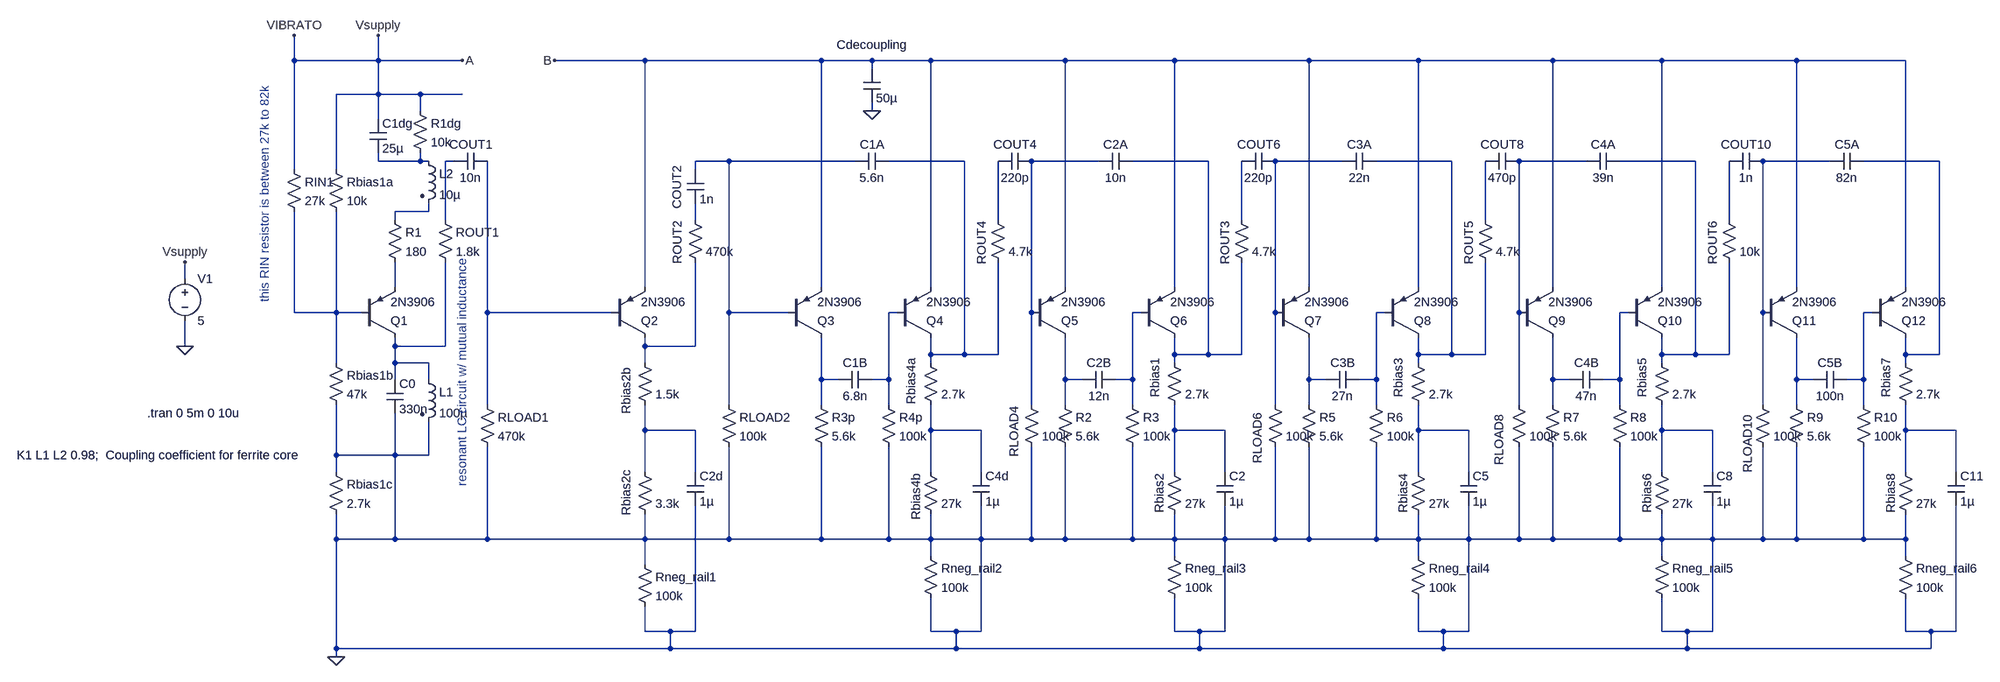
[diagram p0: schematic Farfisa 12-Tone Generator Osc Card G-10.asc]
Farfisa 12-Tone Generator Osc Card G-10.asc, the LTspice schematic file:
Version 4.1
SHEET 1 3172 916
WIRE -160 -240 -160 -288
WIRE 0 -240 0 -288
WIRE 0 -240 -160 -240
WIRE 160 -240 0 -240
WIRE 528 -240 336 -240
WIRE 864 -240 528 -240
WIRE 960 -240 864 -240
WIRE 1072 -240 960 -240
WIRE 1328 -240 1072 -240
WIRE 1536 -240 1328 -240
WIRE 1792 -240 1536 -240
WIRE 2000 -240 1792 -240
WIRE 2256 -240 2000 -240
WIRE 2464 -240 2256 -240
WIRE 2720 -240 2464 -240
WIRE 2928 -240 2720 -240
WIRE 960 -224 960 -240
WIRE 0 -176 0 -240
WIRE 0 -176 -80 -176
WIRE 80 -176 0 -176
WIRE 160 -176 80 -176
WIRE 80 -144 80 -176
WIRE 960 -144 960 -160
WIRE 0 -128 0 -176
WIRE 0 -48 0 -64
WIRE 80 -48 80 -64
WIRE 80 -48 0 -48
WIRE 96 -48 80 -48
WIRE 144 -48 128 -48
WIRE 688 -48 624 -48
WIRE 928 -48 688 -48
WIRE 1136 -48 992 -48
WIRE 1392 -48 1264 -48
WIRE 1600 -48 1456 -48
WIRE 1856 -48 1728 -48
WIRE 2064 -48 1920 -48
WIRE 2320 -48 2192 -48
WIRE 2528 -48 2384 -48
WIRE 2784 -48 2656 -48
WIRE 2992 -48 2848 -48
WIRE -160 -32 -160 -240
WIRE -80 -32 -80 -176
WIRE 624 -32 624 -48
WIRE 96 48 96 32
WIRE 96 48 32 48
WIRE 32 64 32 48
WIRE 128 64 128 -48
WIRE 624 64 624 32
WIRE 1200 64 1200 -48
WIRE 1664 64 1664 -48
WIRE 2128 64 2128 -48
WIRE 2592 64 2592 -48
WIRE -368 176 -368 144
WIRE 32 192 32 144
WIRE 528 192 528 -240
WIRE 864 192 864 -240
WIRE 1072 192 1072 -240
WIRE 1328 192 1328 -240
WIRE 1536 192 1536 -240
WIRE 1792 192 1792 -240
WIRE 2000 192 2000 -240
WIRE 2256 192 2256 -240
WIRE 2464 192 2464 -240
WIRE 2720 192 2720 -240
WIRE 2928 192 2928 -240
WIRE -160 240 -160 48
WIRE -80 240 -80 48
WIRE -80 240 -160 240
WIRE -32 240 -80 240
WIRE 208 240 208 -48
WIRE 464 240 208 240
WIRE 688 240 688 -48
WIRE 800 240 688 240
WIRE 1008 240 992 240
WIRE 1264 240 1264 -48
WIRE 1472 240 1456 240
WIRE 1728 240 1728 -48
WIRE 1936 240 1920 240
WIRE 2192 240 2192 -48
WIRE 2400 240 2384 240
WIRE 2656 240 2656 -48
WIRE 2864 240 2848 240
WIRE -368 304 -368 256
WIRE 32 304 32 288
WIRE 128 304 128 144
WIRE 128 304 32 304
WIRE 528 304 528 288
WIRE 624 304 624 144
WIRE 624 304 528 304
WIRE 1072 320 1072 288
WIRE 1136 320 1136 -48
WIRE 1136 320 1072 320
WIRE 1200 320 1200 144
WIRE 1200 320 1136 320
WIRE 1536 320 1536 288
WIRE 1600 320 1600 -48
WIRE 1600 320 1536 320
WIRE 1664 320 1664 144
WIRE 1664 320 1600 320
WIRE 2000 320 2000 288
WIRE 2064 320 2064 -48
WIRE 2064 320 2000 320
WIRE 2128 320 2128 144
WIRE 2128 320 2064 320
WIRE 2464 320 2464 288
WIRE 2528 320 2528 -48
WIRE 2528 320 2464 320
WIRE 2592 320 2592 144
WIRE 2592 320 2528 320
WIRE 2928 320 2928 288
WIRE 2992 320 2992 -48
WIRE 2992 320 2928 320
WIRE -80 336 -80 240
WIRE 32 336 32 304
WIRE 96 336 32 336
WIRE 528 336 528 304
WIRE 1072 336 1072 320
WIRE 1536 336 1536 320
WIRE 2000 336 2000 320
WIRE 2464 336 2464 320
WIRE 2928 336 2928 320
WIRE 32 368 32 336
WIRE 96 368 96 336
WIRE 864 368 864 288
WIRE 896 368 864 368
WIRE 992 368 992 240
WIRE 992 368 960 368
WIRE 1328 368 1328 288
WIRE 1360 368 1328 368
WIRE 1456 368 1456 240
WIRE 1456 368 1424 368
WIRE 1792 368 1792 288
WIRE 1824 368 1792 368
WIRE 1920 368 1920 240
WIRE 1920 368 1888 368
WIRE 2256 368 2256 288
WIRE 2288 368 2256 368
WIRE 2384 368 2384 240
WIRE 2384 368 2352 368
WIRE 2720 368 2720 288
WIRE 2752 368 2720 368
WIRE 2848 368 2848 240
WIRE 2848 368 2816 368
WIRE 208 416 208 240
WIRE 688 416 688 240
WIRE 864 416 864 368
WIRE 992 416 992 368
WIRE 1264 416 1264 240
WIRE 1328 416 1328 368
WIRE 1456 416 1456 368
WIRE 1728 416 1728 240
WIRE 1792 416 1792 368
WIRE 1920 416 1920 368
WIRE 2192 416 2192 240
WIRE 2256 416 2256 368
WIRE 2384 416 2384 368
WIRE 2656 416 2656 240
WIRE 2720 416 2720 368
WIRE 2848 416 2848 368
WIRE 528 464 528 416
WIRE 624 464 528 464
WIRE 1072 464 1072 416
WIRE 1168 464 1072 464
WIRE 1536 464 1536 416
WIRE 1632 464 1536 464
WIRE 2000 464 2000 416
WIRE 2096 464 2000 464
WIRE 2464 464 2464 416
WIRE 2560 464 2464 464
WIRE 2928 464 2928 416
WIRE 3024 464 2928 464
WIRE -80 512 -80 416
WIRE 32 512 32 432
WIRE 32 512 -80 512
WIRE 96 512 96 448
WIRE 96 512 32 512
WIRE -80 544 -80 512
WIRE 528 544 528 464
WIRE 624 544 624 464
WIRE 1072 544 1072 464
WIRE 1168 544 1168 464
WIRE 1536 544 1536 464
WIRE 1632 544 1632 464
WIRE 2000 544 2000 464
WIRE 2096 544 2096 464
WIRE 2464 544 2464 464
WIRE 2560 544 2560 464
WIRE 2928 544 2928 464
WIRE 3024 544 3024 464
WIRE -80 672 -80 624
WIRE 32 672 32 512
WIRE 32 672 -80 672
WIRE 208 672 208 496
WIRE 208 672 32 672
WIRE 528 672 528 624
WIRE 528 672 208 672
WIRE 688 672 688 496
WIRE 688 672 528 672
WIRE 864 672 864 496
WIRE 864 672 688 672
WIRE 992 672 992 496
WIRE 992 672 864 672
WIRE 1072 672 1072 624
WIRE 1072 672 992 672
WIRE 1168 672 1168 608
WIRE 1168 672 1072 672
WIRE 1264 672 1264 496
WIRE 1264 672 1168 672
WIRE 1328 672 1328 496
WIRE 1328 672 1264 672
WIRE 1456 672 1456 496
WIRE 1456 672 1328 672
WIRE 1536 672 1536 624
WIRE 1536 672 1456 672
WIRE 1632 672 1632 608
WIRE 1632 672 1536 672
WIRE 1728 672 1728 496
WIRE 1728 672 1632 672
WIRE 1792 672 1792 496
WIRE 1792 672 1728 672
WIRE 1920 672 1920 496
WIRE 1920 672 1792 672
WIRE 2000 672 2000 624
WIRE 2000 672 1920 672
WIRE 2096 672 2096 608
WIRE 2096 672 2000 672
WIRE 2192 672 2192 496
WIRE 2192 672 2096 672
WIRE 2256 672 2256 496
WIRE 2256 672 2192 672
WIRE 2384 672 2384 496
WIRE 2384 672 2256 672
WIRE 2464 672 2464 624
WIRE 2464 672 2384 672
WIRE 2560 672 2560 608
WIRE 2560 672 2464 672
WIRE 2656 672 2656 496
WIRE 2656 672 2560 672
WIRE 2720 672 2720 496
WIRE 2720 672 2656 672
WIRE 2848 672 2848 496
WIRE 2848 672 2720 672
WIRE 2928 672 2928 624
WIRE 2928 672 2848 672
WIRE 1072 704 1072 672
WIRE 1536 704 1536 672
WIRE 2000 704 2000 672
WIRE 2464 704 2464 672
WIRE 2928 704 2928 672
WIRE 528 720 528 672
WIRE 528 848 528 800
WIRE 576 848 528 848
WIRE 624 848 624 608
WIRE 624 848 576 848
WIRE 1072 848 1072 784
WIRE 1120 848 1072 848
WIRE 1168 848 1168 672
WIRE 1168 848 1120 848
WIRE 1536 848 1536 784
WIRE 1584 848 1536 848
WIRE 1632 848 1632 672
WIRE 1632 848 1584 848
WIRE 2000 848 2000 784
WIRE 2048 848 2000 848
WIRE 2096 848 2096 672
WIRE 2096 848 2048 848
WIRE 2464 848 2464 784
WIRE 2512 848 2464 848
WIRE 2560 848 2560 672
WIRE 2560 848 2512 848
WIRE 2928 848 2928 784
WIRE 2976 848 2928 848
WIRE 3024 848 3024 608
WIRE 3024 848 2976 848
WIRE -80 880 -80 672
WIRE 576 880 576 848
WIRE 576 880 -80 880
WIRE 1120 880 1120 848
WIRE 1120 880 576 880
WIRE 1584 880 1584 848
WIRE 1584 880 1120 880
WIRE 2048 880 2048 848
WIRE 2048 880 1584 880
WIRE 2512 880 2512 848
WIRE 2512 880 2048 880
WIRE 2976 880 2976 848
WIRE 2976 880 2512 880
WIRE -80 896 -80 880
FLAG -368 304 0
FLAG -368 144 Vsupply
FLAG -160 -288 VIBRATO
FLAG 0 -288 Vsupply
FLAG -80 896 0
FLAG 160 -240 A
FLAG 336 -240 B
FLAG 960 -144 0
SYMBOL pnp -32 288 M180
SYMATTR InstName Q1
SYMATTR Value 2N3906
SYMBOL Res 16 48 R0
SYMATTR InstName R1
SYMATTR Value 180
SYMBOL ind2 80 -64 R0
SYMATTR InstName L2
SYMATTR Value 10µ
SYMATTR Type ind
SYMBOL Cap -16 -128 R0
SYMATTR InstName C1dg
SYMATTR Value 25µ
SYMBOL Res 64 -160 R0
SYMATTR InstName R1dg
SYMATTR Value 10k
SYMBOL Cap 16 368 R0
SYMATTR InstName C0
SYMATTR Value 330n
SYMBOL ind2 80 352 R0
SYMATTR InstName L1
SYMATTR Value 100µ
SYMATTR Type ind
SYMBOL Res -96 320 R0
SYMATTR InstName Rbias1b
SYMATTR Value 47k
SYMBOL Res -96 528 R0
SYMATTR InstName Rbias1c
SYMATTR Value 2.7k
SYMBOL Res -96 -48 R0
SYMATTR InstName Rbias1a
SYMATTR Value 10k
SYMBOL Res -176 -48 R0
SYMATTR InstName RIN1
SYMATTR Value 27k
SYMBOL Res 112 48 R0
SYMATTR InstName ROUT1
SYMATTR Value 1.8k
SYMBOL Cap 208 -64 R90
WINDOW 0 0 32 VBottom 2
WINDOW 3 32 32 VTop 2
SYMATTR InstName COUT1
SYMATTR Value 10n
SYMBOL Res 192 400 R0
SYMATTR InstName RLOAD1
SYMATTR Value 470k
SYMBOL Voltage -368 160 R0
SYMATTR InstName V1
SYMATTR Value 5
SYMBOL pnp 464 288 M180
SYMATTR InstName Q2
SYMATTR Value 2N3906
SYMBOL res 512 320 R0
WINDOW 0 -19 25 VRight 2
SYMATTR InstName Rbias2b
SYMATTR Value 1.5k
SYMBOL res 512 528 R0
WINDOW 0 -19 12 VRight 2
SYMATTR InstName Rbias2c
SYMATTR Value 3.3k
SYMBOL cap 608 544 R0
SYMATTR InstName C2d
SYMATTR Value 1µ
SYMBOL res 512 704 R0
SYMATTR InstName Rneg_rail1
SYMATTR Value 100k
SYMBOL res 608 48 R0
WINDOW 0 -18 18 VRight 2
SYMATTR InstName ROUT2
SYMATTR Value 470k
SYMBOL cap 608 -32 R0
WINDOW 0 -19 -7 VRight 2
SYMATTR InstName COUT2
SYMATTR Value 1n
SYMBOL res 672 400 R0
SYMATTR InstName RLOAD2
SYMATTR Value 100k
SYMBOL pnp 800 288 M180
SYMATTR InstName Q3
SYMATTR Value 2N3906
SYMBOL res 848 400 R0
SYMATTR InstName R3p
SYMATTR Value 5.6k
SYMBOL cap 960 352 R90
WINDOW 0 0 32 VBottom 2
WINDOW 3 32 32 VTop 2
SYMATTR InstName C1B
SYMATTR Value 6.8n
SYMBOL res 976 400 R0
SYMATTR InstName R4p
SYMATTR Value 100k
SYMBOL pnp 1008 288 M180
SYMATTR InstName Q4
SYMATTR Value 2N3906
SYMBOL res 1056 320 R0
WINDOW 0 -21 7 VRight 2
SYMATTR InstName Rbias4a
SYMATTR Value 2.7k
SYMBOL res 1056 528 R0
WINDOW 0 -12 19 VRight 2
SYMATTR InstName Rbias4b
SYMATTR Value 27k
SYMBOL cap 1152 544 R0
SYMATTR InstName C4d
SYMATTR Value 1µ
SYMBOL cap 992 -64 R90
WINDOW 0 0 32 VBottom 2
WINDOW 3 32 32 VTop 2
SYMATTR InstName C1A
SYMATTR Value 5.6n
SYMBOL cap 944 -224 R0
WINDOW 0 -51 -46 Left 2
SYMATTR InstName Cdecoupling
SYMATTR Value 50µ
SYMBOL res 1184 48 R0
WINDOW 0 -15 19 VRight 2
SYMATTR InstName ROUT4
SYMATTR Value 4.7k
SYMBOL cap 1264 -64 R90
WINDOW 0 0 32 VBottom 2
WINDOW 3 32 32 VTop 2
SYMATTR InstName COUT4
SYMATTR Value 220p
SYMBOL pnp 1264 288 M180
SYMATTR InstName Q5
SYMATTR Value 2N3906
SYMBOL res 1312 400 R0
SYMATTR InstName R2
SYMATTR Value 5.6k
SYMBOL cap 1424 352 R90
WINDOW 0 0 32 VBottom 2
WINDOW 3 32 32 VTop 2
SYMATTR InstName C2B
SYMATTR Value 12n
SYMBOL res 1440 400 R0
SYMATTR InstName R3
SYMATTR Value 100k
SYMBOL pnp 1472 288 M180
SYMATTR InstName Q6
SYMATTR Value 2N3906
SYMBOL res 1520 320 R0
WINDOW 0 -21 7 VRight 2
SYMATTR InstName Rbias1
SYMATTR Value 2.7k
SYMBOL res 1520 528 R0
WINDOW 0 -12 19 VRight 2
SYMATTR InstName Rbias2
SYMATTR Value 27k
SYMBOL cap 1616 544 R0
SYMATTR InstName C2
SYMATTR Value 1µ
SYMBOL cap 1456 -64 R90
WINDOW 0 0 32 VBottom 2
WINDOW 3 32 32 VTop 2
SYMATTR InstName C2A
SYMATTR Value 10n
SYMBOL res 1648 48 R0
WINDOW 0 -15 19 VRight 2
SYMATTR InstName ROUT3
SYMATTR Value 4.7k
SYMBOL cap 1728 -64 R90
WINDOW 0 0 32 VBottom 2
WINDOW 3 32 32 VTop 2
SYMATTR InstName COUT6
SYMATTR Value 220p
SYMBOL res 1776 400 R0
SYMATTR InstName R5
SYMATTR Value 5.6k
SYMBOL cap 1888 352 R90
WINDOW 0 0 32 VBottom 2
WINDOW 3 32 32 VTop 2
SYMATTR InstName C3B
SYMATTR Value 27n
SYMBOL res 1904 400 R0
SYMATTR InstName R6
SYMATTR Value 100k
SYMBOL res 1984 320 R0
WINDOW 0 -21 7 VRight 2
SYMATTR InstName Rbias3
SYMATTR Value 2.7k
SYMBOL res 1984 528 R0
WINDOW 0 -12 19 VRight 2
SYMATTR InstName Rbias4
SYMATTR Value 27k
SYMBOL cap 2080 544 R0
SYMATTR InstName C5
SYMATTR Value 1µ
SYMBOL cap 1920 -64 R90
WINDOW 0 0 32 VBottom 2
WINDOW 3 32 32 VTop 2
SYMATTR InstName C3A
SYMATTR Value 22n
SYMBOL res 2112 48 R0
WINDOW 0 -15 19 VRight 2
SYMATTR InstName ROUT5
SYMATTR Value 4.7k
SYMBOL cap 2192 -64 R90
WINDOW 0 0 32 VBottom 2
WINDOW 3 32 32 VTop 2
SYMATTR InstName COUT8
SYMATTR Value 470p
SYMBOL pnp 1728 288 M180
SYMATTR InstName Q7
SYMATTR Value 2N3906
SYMBOL pnp 1936 288 M180
SYMATTR InstName Q8
SYMATTR Value 2N3906
SYMBOL res 2240 400 R0
SYMATTR InstName R7
SYMATTR Value 5.6k
SYMBOL cap 2352 352 R90
WINDOW 0 0 32 VBottom 2
WINDOW 3 32 32 VTop 2
SYMATTR InstName C4B
SYMATTR Value 47n
SYMBOL res 2368 400 R0
SYMATTR InstName R8
SYMATTR Value 100k
SYMBOL res 2448 320 R0
WINDOW 0 -21 7 VRight 2
SYMATTR InstName Rbias5
SYMATTR Value 2.7k
SYMBOL res 2448 528 R0
WINDOW 0 -12 19 VRight 2
SYMATTR InstName Rbias6
SYMATTR Value 27k
SYMBOL cap 2544 544 R0
SYMATTR InstName C8
SYMATTR Value 1µ
SYMBOL cap 2384 -64 R90
WINDOW 0 0 32 VBottom 2
WINDOW 3 32 32 VTop 2
SYMATTR InstName C4A
SYMATTR Value 39n
SYMBOL res 2576 48 R0
WINDOW 0 -15 19 VRight 2
SYMATTR InstName ROUT6
SYMATTR Value 10k
SYMBOL cap 2656 -64 R90
WINDOW 0 0 32 VBottom 2
WINDOW 3 32 32 VTop 2
SYMATTR InstName COUT10
SYMATTR Value 1n
SYMBOL pnp 2192 288 M180
SYMATTR InstName Q9
SYMATTR Value 2N3906
SYMBOL pnp 2400 288 M180
SYMATTR InstName Q10
SYMATTR Value 2N3906
SYMBOL res 2704 400 R0
SYMATTR InstName R9
SYMATTR Value 5.6k
SYMBOL cap 2816 352 R90
WINDOW 0 0 32 VBottom 2
WINDOW 3 32 32 VTop 2
SYMATTR InstName C5B
SYMATTR Value 100n
SYMBOL res 2832 400 R0
SYMATTR InstName R10
SYMATTR Value 100k
SYMBOL res 2912 320 R0
WINDOW 0 -21 7 VRight 2
SYMATTR InstName Rbias7
SYMATTR Value 2.7k
SYMBOL res 2912 528 R0
WINDOW 0 -12 19 VRight 2
SYMATTR InstName Rbias8
SYMATTR Value 27k
SYMBOL cap 3008 544 R0
SYMATTR InstName C11
SYMATTR Value 1µ
SYMBOL cap 2848 -64 R90
WINDOW 0 0 32 VBottom 2
WINDOW 3 32 32 VTop 2
SYMATTR InstName C5A
SYMATTR Value 82n
SYMBOL pnp 2656 288 M180
SYMATTR InstName Q11
SYMATTR Value 2N3906
SYMBOL pnp 2864 288 M180
SYMATTR InstName Q12
SYMATTR Value 2N3906
SYMBOL res 1248 400 R0
WINDOW 0 -17 19 VRight 2
SYMATTR InstName RLOAD4
SYMATTR Value 100k
SYMBOL res 1712 400 R0
WINDOW 0 -18 32 VRight 2
SYMATTR InstName RLOAD6
SYMATTR Value 100k
SYMBOL res 2176 400 R0
WINDOW 0 -22 35 VRight 2
SYMATTR InstName RLOAD8
SYMATTR Value 100k
SYMBOL res 2640 400 R0
WINDOW 0 -12 36 VRight 2
SYMATTR InstName RLOAD10
SYMATTR Value 100k
SYMBOL res 1056 688 R0
SYMATTR InstName Rneg_rail2
SYMATTR Value 100k
SYMBOL res 1520 688 R0
SYMATTR InstName Rneg_rail3
SYMATTR Value 100k
SYMBOL res 1984 688 R0
SYMATTR InstName Rneg_rail4
SYMATTR Value 100k
SYMBOL res 2448 688 R0
SYMATTR InstName Rneg_rail5
SYMATTR Value 100k
SYMBOL res 2912 688 R0
SYMATTR InstName Rneg_rail6
SYMATTR Value 100k
TEXT 160 136 VRight 2 ;resonant LC circuit w/ mutual inductance
TEXT -216 -192 VRight 2 ;this RIN resistor is between 27k to 82k
TEXT -688 512 Left 2 !K1 L1 L2 0.98;  Coupling coefficient for ferrite core
TEXT -440 432 Left 2 !.tran 0 5m 0 10u

The netlist it stands for:
* Farfisa 12-Tone Generator Osc Card G-10.asc
Q1 N027 N020 N019 0 2N3906
R1 N013 N019 180
L2 N001 N013 10µ
C1dg A N001 25µ
R1dg A N001 10k
C0 N027 0 330n
L1 N027 0 100µ
Rbias1b N020 0 47k
Rbias1c 0 0 2.7k
Rbias1a A N020 10k
RIN1 A N020 27k
ROUT1 N002 N027 1.8k
COUT1 N021 N002 10n
RLOAD1 N021 0 470k
V1 A 0 5
Q2 N028 N021 B 0 2N3906
Rbias2b N028 N034 1.5k
Rbias2c N034 0 3.3k
C2d N034 0 1µ
Rneg_rail1 0 0 100k
ROUT2 N014 N028 470k
COUT2 N003 N014 1n
RLOAD2 N003 0 100k
Q3 N029 N003 B 0 2N3906
R3p N029 0 5.6k
C1B N022 N029 6.8n
R4p N022 0 100k
Q4 N004 N022 B 0 2N3906
Rbias4a N004 N035 2.7k
Rbias4b N035 0 27k
C4d N035 0 1µ
C1A N004 N003 5.6n
Cdecoupling B 0 50µ
ROUT4 N015 N004 4.7k
COUT4 N005 N015 220p
Q5 N030 N005 B 0 2N3906
R2 N030 0 5.6k
C2B N023 N030 12n
R3 N023 0 100k
Q6 N006 N023 B 0 2N3906
Rbias1 N006 N036 2.7k
Rbias2 N036 0 27k
C2 N036 0 1µ
C2A N006 N005 10n
ROUT3 N016 N006 4.7k
COUT6 N007 N016 220p
R5 N031 0 5.6k
C3B N024 N031 27n
R6 N024 0 100k
Rbias3 N008 N037 2.7k
Rbias4 N037 0 27k
C5 N037 0 1µ
C3A N008 N007 22n
ROUT5 N017 N008 4.7k
COUT8 N009 N017 470p
Q7 N031 N007 B 0 2N3906
Q8 N008 N024 B 0 2N3906
R7 N032 0 5.6k
C4B N025 N032 47n
R8 N025 0 100k
Rbias5 N010 N038 2.7k
Rbias6 N038 0 27k
C8 N038 0 1µ
C4A N010 N009 39n
ROUT6 N018 N010 10k
COUT10 N011 N018 1n
Q9 N032 N009 B 0 2N3906
Q10 N010 N025 B 0 2N3906
R9 N033 0 5.6k
C5B N026 N033 100n
R10 N026 0 100k
Rbias7 N012 N039 2.7k
Rbias8 N039 0 27k
C11 N039 0 1µ
C5A N012 N011 82n
Q11 N033 N011 B 0 2N3906
Q12 N012 N026 B 0 2N3906
RLOAD4 N005 0 100k
RLOAD6 N007 0 100k
RLOAD8 N009 0 100k
RLOAD10 N011 0 100k
Rneg_rail2 0 0 100k
Rneg_rail3 0 0 100k
Rneg_rail4 0 0 100k
Rneg_rail5 0 0 100k
Rneg_rail6 0 0 100k
.model NPN NPN
.model PNP PNP
.lib standard.bjt
* resonant LC circuit w/ mutual inductance
* this RIN resistor is between 27k to 82k
K1 L1 L2 0.98;  Coupling coefficient for ferrite core
.tran 0 5m 0 10u
.backanno
.end